# EAGLE design lm3410-boost-flashlight-driver-17mm-mk-1.0.2 (EAGLE 6.6.0)
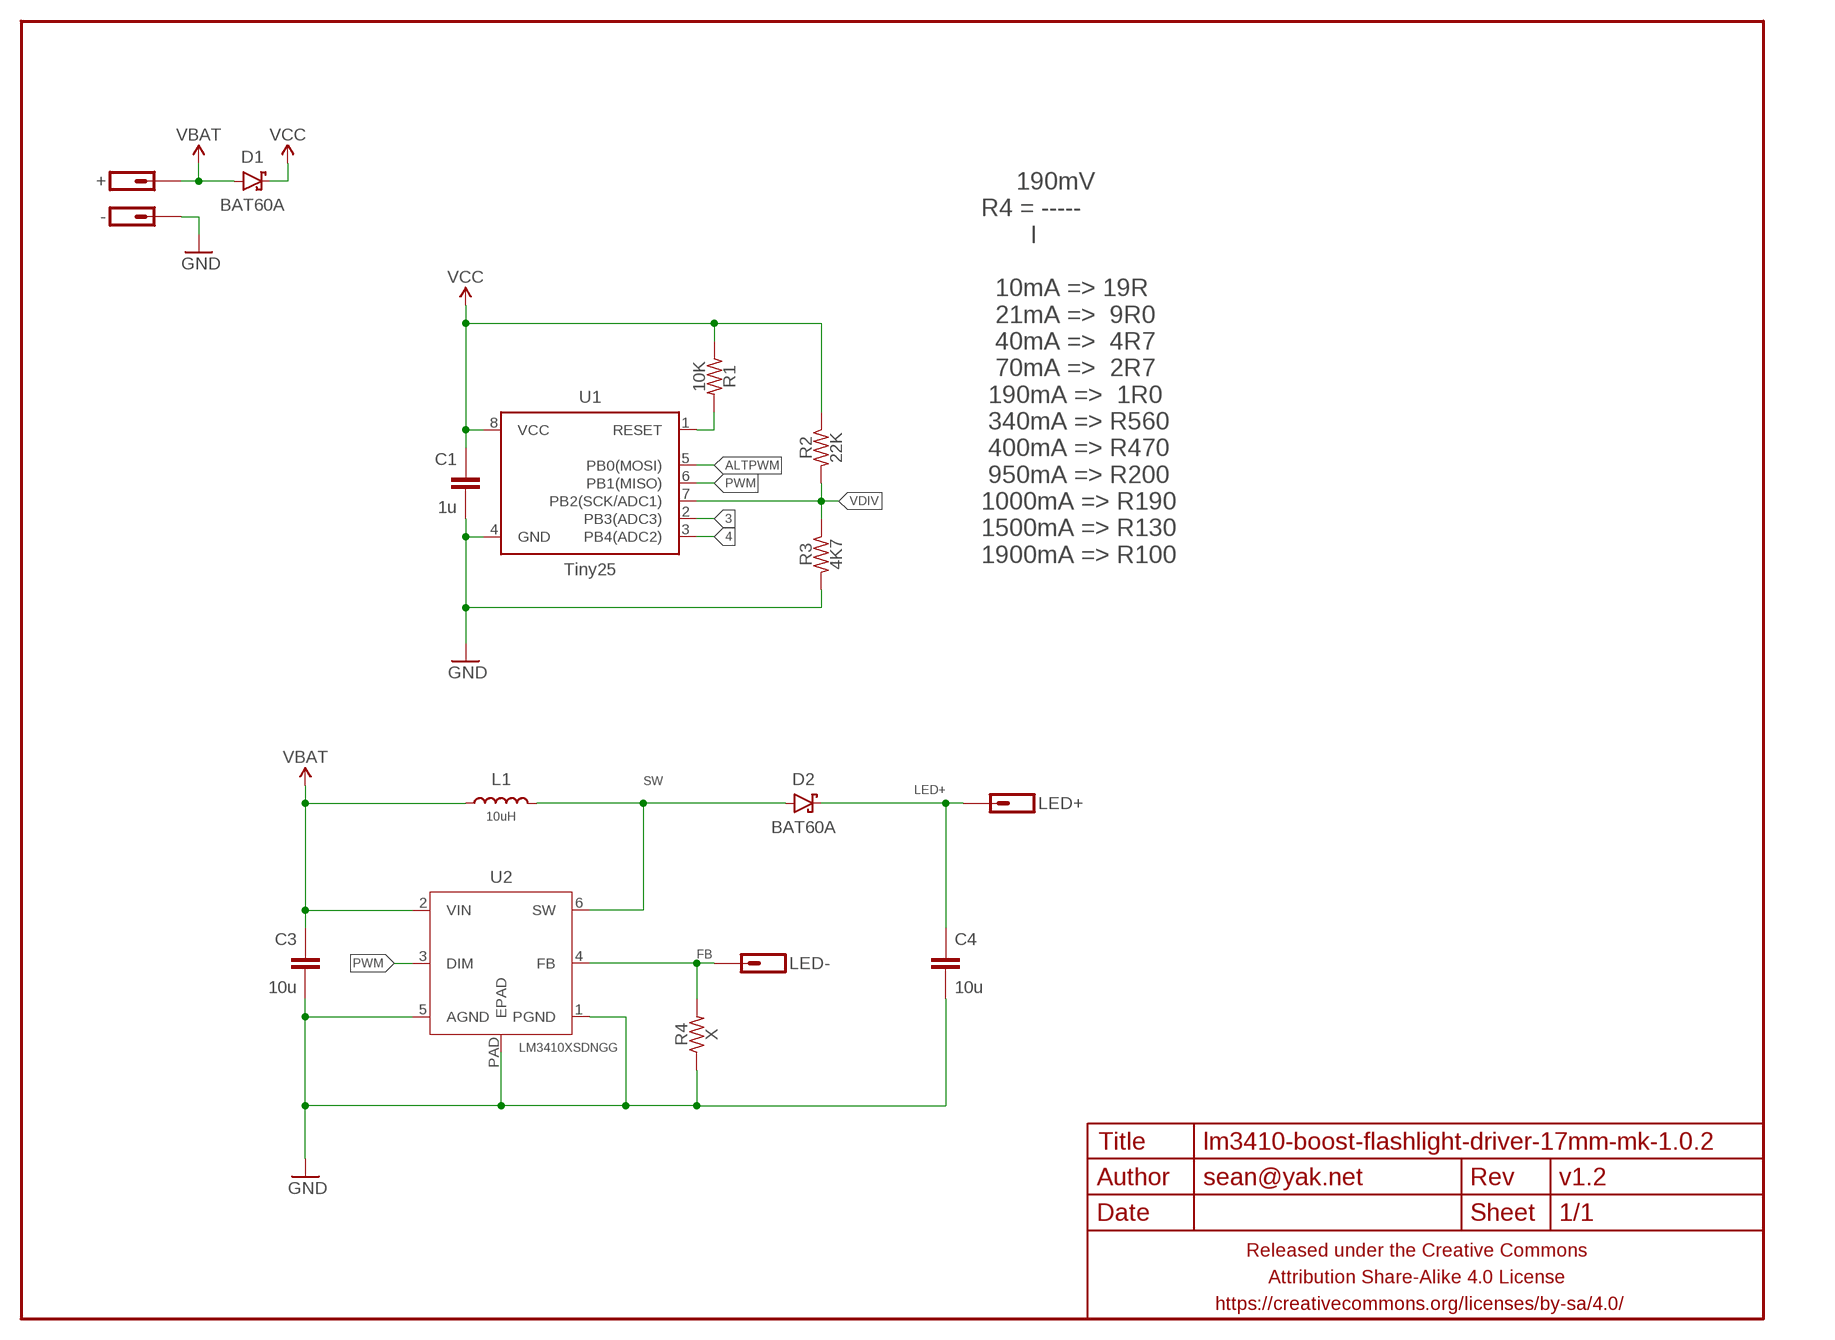
[diagram p0: schematic, sheet 1]

## Parts
+  M01PTH-1MM-CIR-NS  [1X01-1MM-CIR-NS]
-  M01NOT-A-VIA-NOPE  [1X01_NOSILK_NOSTOP]
C1  1u  CAPACITOR-CERAMICC0402  [C0402]
C3  10u  CAPACITOR-CERAMICC0805-TIGHTER  [C0805-TIGHTER]
C4  10u  CAPACITOR-CERAMICC0805-TIGHTER  [C0805-TIGHTER]
D1  BAT60A  DIODE-SCHOTTKYSOD323  [SOD323-SCHOTTKY]
D2  BAT60A  DIODE-SCHOTTKYSOD323  [SOD323-SCHOTTKY]
FRAME1  FRAME-LETTERNO_PACKAGE  [DUMMY]
L1  10uH  INDUCTORXFL4020  [XFL4020]
LED+  M01PTH-1MM-CIR-NS  [1X01-1MM-CIR-NS]
LED-  M01PTH-1MM-CIR-NS  [1X01-1MM-CIR-NS]
R1  10K  RESISTORR0402  [R0402]
R2  22K  RESISTORR0402  [R0402]
R3  4K7  RESISTORR0402  [R0402]
R4  X  RESISTORR0805-TIGHTER  [R0805-TIGHTER]
U1  Tiny25  ATTINY45TINY25-SOICN-NARROWER  [SO08-SKINNYPADS]
U2  LM3410XSDNGG  [DFN300X300X80-7N]

## Nets
3: U1.2(PB3(ADC3))
4: U1.3(PB4(ADC2))
ALTPWM: U1.5(PB0(MOSI))
FB: LED-.1 R4.2 U2.4(FB)
GND: -.P$1 C1.2 C3.2 C4.2 R3.2 R4.1 U1.4(GND) U2.1(PGND) U2.5(AGND) U2.PAD(EPAD)
LED+: C4.1 D2.C LED+.1
N$1: R1.2 U1.1(RESET)
PWM: U1.6(PB1(MISO)) U2.3(DIM)
SW: D2.A L1.P$2 U2.6(SW)
VBAT: +.1 C3.1 D1.A L1.P$1 U2.2(VIN)
VCC: C1.1 D1.C R1.1 R2.1 U1.8(VCC)
VDIV: R2.2 R3.1 U1.7(PB2(SCK/ADC1))

## Notes on the sheet
- 190mV
  R4 = -----
         I
  
    10mA => 19R
    21mA =>  9R0
    40mA =>  4R7
    70mA =>  2R7
   190mA =>  1R0
   340mA => R560
   400mA => R470
   950mA => R200
  1000mA => R190
  1500mA => R130
  1900mA => R100

## Library data of the parts
+ - LED+ LED- = a_parts:M01: Header 1 Standard 1-pin 0.1" header. Use with straight break away headers (SKU : PRT-00116), right angle break away headers (PRT-00553), swiss pins (PRT-00743), machine pins (PRT-00117), and female headers (PRT-00115).
C1 C3 C4 = a_parts:CAPACITOR-CERAMIC: CAPACITOR, European symbol
D1 D2 = a_parts:DIODE-SCHOTTKY: Schottky diodes in SFE's production catalog BAT20J 1A 23V 0.62Vf RB751 120mA 40V 0.37Vf PMEG4005EJ 0.5A 40V 0.42Vf MBRA140 1A 40V 0.5Vf B340A 3A 40V SMA
FRAME1 = a_parts:FRAME-LETTER: Schematic Frame Standard 8.5x11 US Letter frame; DESIGNER: sean@yak.net; VERSION: v1.2
L1 = a_parts:INDUCTOR: Inductors Basic Inductor/Choke - 0603 and 1206. Footprints are not proven and vary greatly between part numbers. SRN6045- 33uH, 20% 1.4A SDR0403-560KL - 56uH, 10%, 500mA RMS/740mA peak
R1-R4 = a_parts:RESISTOR: RESISTOR, American symbol
U1 = a_parts:ATTINY45: Atmel 8-pin 2/4/8kB flash uC
U2 = a_parts:LM3410XSD: Constant Current Boost and SEPIC LED Driver; MPN: LM3410XSD; OC_FARNELL: -; OC_NEWARK: 11N9218; PACKAGE: DFN-6; SUPPLIER: National Semiconductor

## Board
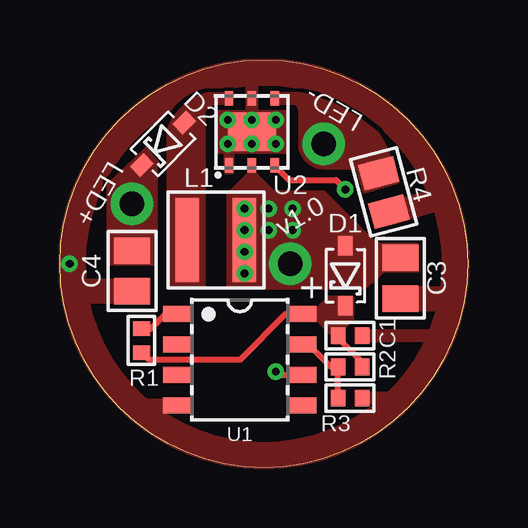
[diagram p1: board, top side]
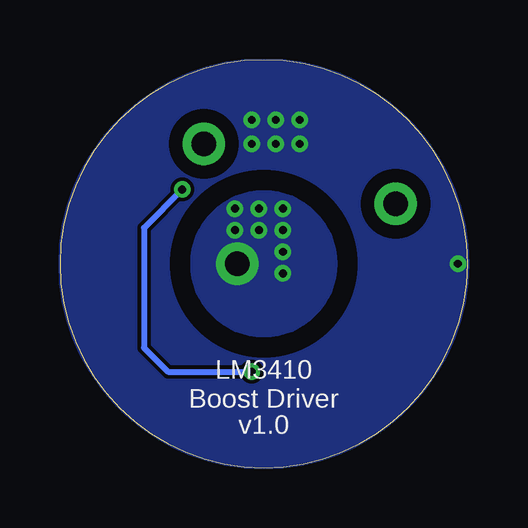
[diagram p2: board, bottom side, seen from below]

Size 17 x 17 mm. Coordinates in mm from the lower left corner, seen from the top.
Outline: 0,8.5 arc-180 17,8.5 arc-180 0,8.5
Copper layers (1*16): Top 0.0356mm / dielectric 1.5011mm / Bottom 0.0356mm
Design rules "LaenPCBOrder2 *": minimum track width 6mil, minimum drill 13mil, track to track 6mil, track to pad 6mil, pad to pad 6mil, via to via 6mil, smd to smd 6mil, copper to edge 0mil, drill to drill 6mil, minimum pad ring 7mil, minimum via ring 7mil, stop-mask expansion 3mil, vias tented up to drill 20mil, thermal gap 10mil
bRestrict: area 1.8,9.8 to 4.2,12.2; area 9.8,12.3 to 12.2,14.7; area 5,5 to 12,12

### Footprints (pad centres in the part's own frame; a part is rotated, then mirrored left to right if it is on the bottom)
1X01-1MM-CIR-NS = drill 1.016 pad 1.778: 1 0,0
1X01_NOSILK_NOSTOP = drill 0.33: P$1 0,0
C0402 = smd 0.6 x 0.7: 1 -0.5,0; 2 0.5,0
C0805-TIGHTER = smd 1.1 x 1.5: 1 -0.85,0; 2 0.85,0
SOD323-SCHOTTKY = smd 0.8 x 0.6: A -1.25,0; C 1.25,0
XFL4020 = smd 0.98 x 3.5: P$1 -1.185,0; P$2 1.185,0
R0402 = smd 0.6 x 0.7: 1 -0.5,0; 2 0.5,0
R0805-TIGHTER = smd 1.1 x 1.5: 1 -0.85,0; 2 0.8,0
SO08-SKINNYPADS = smd 0.65 x 1.2: 1 -1.905,-2.6; 2 -0.635,-2.6; 3 0.635,-2.6; 4 1.905,-2.6; 5 1.905,2.6; 6 0.635,2.6; 7 -0.635,2.6; 8 -1.905,2.6
DFN300X300X80-7N = smd 0.6 x 0.35: 1 -1.4,0.95; 2 -1.4,0; 3 -1.4,-0.95; 4 1.4,-0.95; 5 1.4,0; 6 1.4,0.95 | smd 1.6 x 2: PAD 0,0

### Placement (x,y rotation side)
+  9.6,8.5 180 top
-  0.4,8.5 90 bottom
C1  12.1,5.5 0 top
C3  14.2,7.9 270 top
C4  3,8.2 270 top
D1  11.9,8 270 top
D2  4.3,13.5 225 top
FRAME1  0,0 0 top
L1  6.5,9.5 180 top
LED+  3,11 270 top
LED-  11,13.5 180 top
R1  3.4,5.3 90 top
R2  12.1,4.2 180 top
R3  12.1,2.9 0 top
R4  13.5,11.5 105 top
U1  7.5,4.5 270 top
U2  8,14 90 top

### Tracks (layer width: path | path; a pad name or v marks a point on that pad's centre or on a via)
FB
  pour Top (no thermals): 8.9,15.6 8.9,15.2 9.7,15.2 arc-90 10,14.9 10,13.5 arc90 11,12.5 12.4,12.5 12.7,11.5 14.1,11.9 13.8,12.8 13.5,13.5 13.2,14 12.4,14.6 11.5,15.1 10.5,15.5 10,15.6
GND  (via drill 0.33)
  other vias: 7,14.5 8,14.5 9,14.5 7,13.5 8,13.5 9,13.5
  pour Top (isolate 0.152, rank 6, no thermals): 0,8.5 arc90 8.5,0 arc90 17,8.5 16,8.5 arc-90 8.5,1 arc-90 1,8.5
  pour Bottom (isolate 0.152, rank 6, no thermals): 8.5,0 arc-90 0,8.5 arc-90 8.5,17 arc-90 17,8.5 arc-90
  pour Top (isolate 0.152, rank 6, no thermals): 17,8.5 arc90 8.5,17 arc90 0,8.5 1,8.5 arc-90 8.5,16 arc-90 16,8.5
  pour Top (no thermals): 13.3,10.9 13.5,10.1 15.9,10.8 15.7,11.6
  pour Top (no thermals): 13.6,7.5 13.6,6.6 16.5,6.6 16.5,7.5
  pour Top (rank 5, no thermals): 6.9,12.3 7.2,12.3 7.2,13.15 9.5,13.15 9.5,14.85 8.2,14.85 8.2,16.1 7.8,16.1 7.8,14.85 6.5,14.85 6.5,13.15 6.9,13.15
  pour Top (rank 3, no thermals): 3.6,7.8 3.6,6.9 0.5,6.9 0.5,7.8
  pour Top (rank 3, no thermals): 5.3,2.8 5.3,2.4 3.5,2.4 3.5,2.8
  pour Top (rank 3, no thermals): 12.4,5.7 12.4,5.3 15.9,5.3 15.9,5.7
  pour Top (rank 3, no thermals): 12.5,3.1 12.5,2.7 13.7,2.7 13.7,3.1
LED+
  pour Top (rank 3, no thermals): 2,8.5 4,8.5 4,12.6 4.1,12.7 3.6,13.3 2,11.8
N$1
  Top 0.25: U1.1 4.41,6.41 3.8,5.8 R1.2
PWM  (via drill 0.33)
  Top 0.25: U2.3 9.55,12 11.5,12 v11.9,11.6 | v9,4 9.13,3.87 U1.6
  Bottom 0.25: v11.9,11.6 13.5,10 13.5,5 12.5,4 v9,4
SW
  pour Top (rank 3, no thermals): 7.1,15.6 6.2,15.6 arc60 4.5,14 4.5,7.5 6,7.5 6,14.7 arc-90 6.5,15.2 7.1,15.2
VBAT  (via drill 0.33)
  other vias: 8.7,10.8 8.7,9.9 7.7,10.8 7.7,9.9 7.7,9 7.7,8.1 9.7,10.8 9.7,9.9
  pour Bottom (isolate 0.152, no thermals): 5.5,8.5 arc-180 11.5,8.5 arc-180
  pour Top (no thermals): 7,11.4 7,7.5 12.7,7.5 13.5,8.2 14.9,8.2 14.9,9.3 13.2,9.3 11,11.5 8.9,11.5 8.1,12.3 8.1,12.75 7.9,12.75 7.9,12.3
VCC
  Top 0.25: C1.1 11.6,5.4 12.6,4.4 R2.1 | U1.8 9.4,6.41 7.5,4.5 3.7,4.5 R1.1
  pour Top (rank 3, no thermals): 9.6,6.6 9.6,6.2 10.7,6.2 11.4,5.5 11.4,5.2 11.8,5.2 11.8,5.8 12.2,6.2 12.2,7.1 11.2,7.1 10.7,6.6
VDIV
  Top 0.25: R3.1 R2.2 11.3,4.2 10.37,5.13 U1.7

### Text on the board
bPlace: LM3410 / Boost Driver